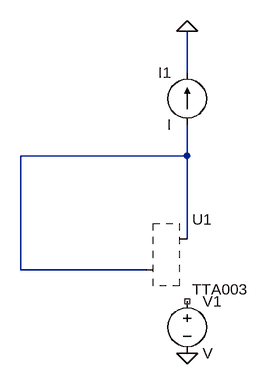
[diagram p0: schematic Draft1.asc]
Draft1.asc, the LTspice schematic file:
Version 4
SHEET 1 880 680
WIRE 160 -144 160 -208
WIRE 160 -16 160 -64
WIRE 160 -16 -96 -16
WIRE 160 112 160 -16
WIRE -96 160 -96 -16
WIRE 96 160 -96 160
FLAG 160 -208 0
FLAG 160 288 0
SYMBOL Contrib\\Toshiba\\bjt\\TTA003 96 112 R0
SYMATTR InstName U1
SYMBOL voltage 160 192 R0
SYMATTR InstName V1
SYMBOL current 160 -64 R180
WINDOW 0 24 80 Left 2
WINDOW 3 24 0 Left 2
SYMATTR InstName I1

The netlist it stands for:
* Draft1.asc
* U1: TTA003 (symbol Contrib\Toshiba\bjt\TTA003 not available, pin order unknown); nets seen at it: N001
V1 NC_01 0 V
I1 N001 0 I
.backanno
.end